# Altium schematic sheet RGB_LED.SchDoc
size A4; SheetNumber: 11; SheetTotal: 11
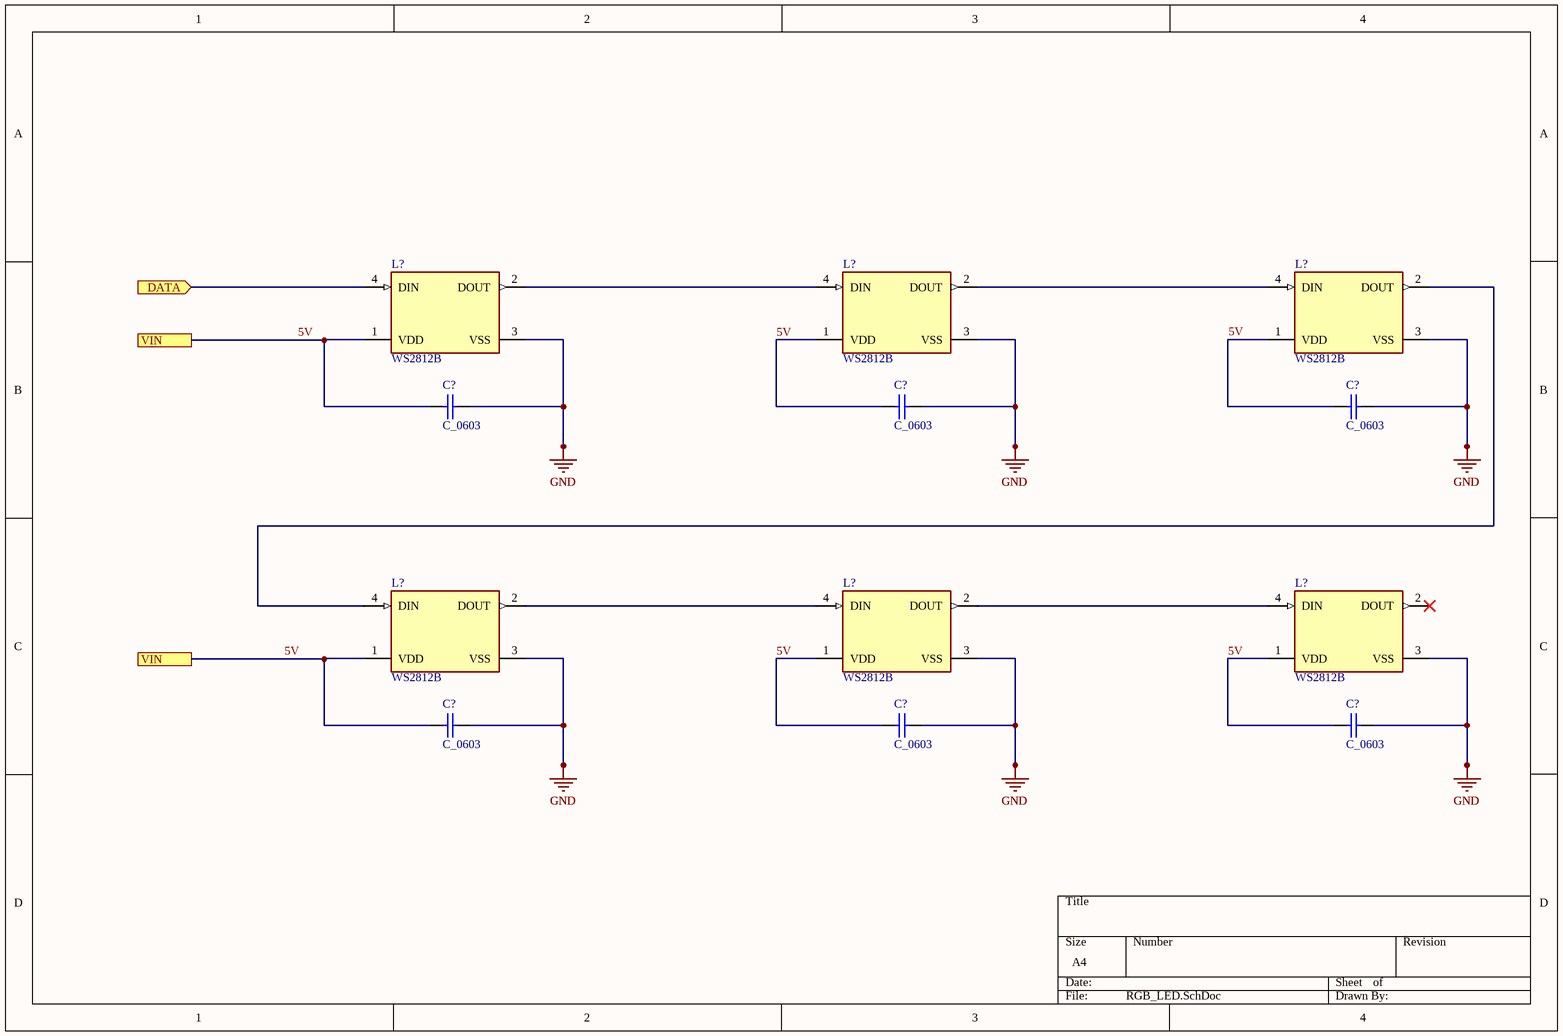
[diagram p0: RGB_LED.SchDoc]

## Parts
(Parts that share a designator on the sheet are numbered #1, #2 ... from top to bottom, then left to right.)
C?#1  C_0603  [C_0603]
C?#2  C_0603  [C_0603]
C?#3  C_0603  [C_0603]
C?#4  C_0603  [C_0603]
C?#5  C_0603  [C_0603]
C?#6  C_0603  [C_0603]
L?#1  WS2812B  [WS2812B]
L?#2  WS2812B  [WS2812B]
L?#3  WS2812B  [WS2812B]
L?#4  WS2812B  [WS2812B]
L?#5  WS2812B  [WS2812B]
L?#6  WS2812B  [WS2812B]

## Ports
DATA (in), VIN

## Nets
GND: C?#1.1 C?#2.1 C?#3.1 C?#4.1 C?#5.1 C?#6.1 L?#1.3(VSS) L?#2.3(VSS) L?#3.3(VSS) L?#4.3(VSS) L?#5.3(VSS) L?#6.3(VSS)
5V: C?#1.2 C?#2.2 C?#3.2 C?#4.2 C?#5.2 C?#6.2 L?#1.1(VDD) L?#2.1(VDD) L?#3.1(VDD) L?#4.1(VDD) L?#5.1(VDD) L?#6.1(VDD) ; port VIN
DATA: L?#1.4(DIN) ; port DATA
NetL?#1_2: L?#1.2(DOUT) L?#2.4(DIN)
NetL?#2_2: L?#2.2(DOUT) L?#3.4(DIN)
NetL?#3_2: L?#3.2(DOUT) L?#4.4(DIN)
NetL?#4_2: L?#4.2(DOUT) L?#5.4(DIN)
NetL?#5_2: L?#5.2(DOUT) L?#6.4(DIN)

Not connected (* = marked no-connect by the designer): L?#6 2(DOUT)*

## Library data of the parts
C?#1-C?#6 = C_0603: D: *; MFR: *; P: *; PN: *; URL: *